# Altium schematic sheet IC's.SchDoc
size Letter
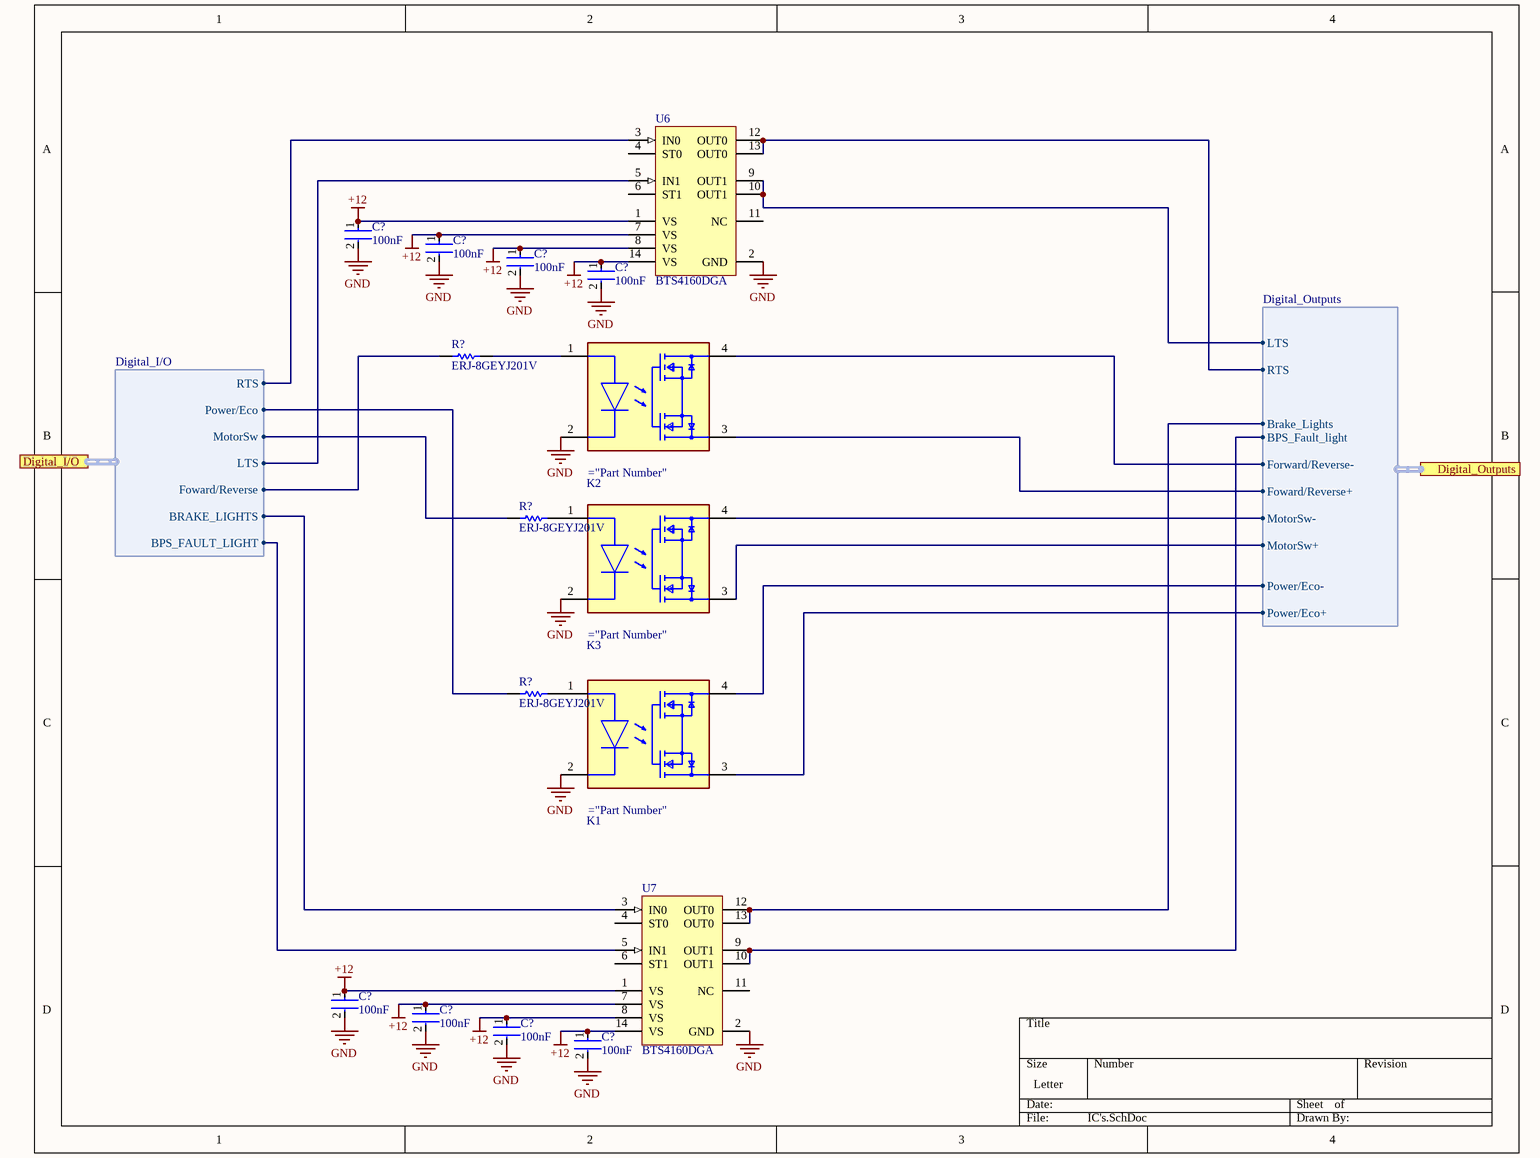
[diagram p0: IC's.SchDoc]

## Parts
(Parts that share a designator on the sheet are numbered #1, #2 ... from top to bottom, then left to right.)
C?#1  100nF  [Kemet_C0603_IPC_A]
C?#2  100nF  [Kemet_C0603_IPC_A]
C?#3  100nF  [Kemet_C0603_IPC_A]
C?#4  100nF  [Kemet_C0603_IPC_A]
C?#5  100nF  [Kemet_C0603_IPC_A]
C?#6  100nF  [Kemet_C0603_IPC_A]
C?#7  100nF  [Kemet_C0603_IPC_A]
C?#8  100nF  [Kemet_C0603_IPC_A]
K1  TLP3123_F  (value not drawn)
K2  TLP3123_F  (value not drawn)
K3  TLP3123_F  (value not drawn)
R?#1  ERJ-8GEYJ201V  [RESC3216X70X50LL05T20]
R?#2  ERJ-8GEYJ201V  [RESC3216X70X50LL05T20]
R?#3  ERJ-8GEYJ201V  [RESC3216X70X50LL05T20]
U6  BTS4160DGA  [INF-PG-DSO-14-37_N]
U7  BTS4160DGA  [INF-PG-DSO-14-37_N]

## Ports
Digital_I/O (harness Digital_I/O), Digital_Outputs (harness Digital_Outputs)

## Harnesses
Digital_I/O: BPS_FAULT_LIGHT, BRAKE_LIGHTS, Foward/Reverse, LTS, MotorSw, Power/Eco, RTS
Digital_Outputs: LTS, RTS, Power/Eco+, Power/Eco-, MotorSw+, MotorSw-, Foward/Reverse+, Forward/Reverse-, Brake_Lights, BPS_Fault_light

## Nets
+12: C?#1.1 C?#2.1 C?#3.1 C?#4.1 C?#5.1 C?#6.1 C?#7.1 C?#8.1 U6.1(VS) U6.7(VS) U6.8(VS) U6.14(VS) U7.1(VS) U7.7(VS) U7.8(VS) U7.14(VS)
GND: C?#1.2 C?#2.2 C?#3.2 C?#4.2 C?#5.2 C?#6.2 C?#7.2 C?#8.2 K1.2(C) K2.2(C) K3.2(C) U6.2(GND) U7.2(GND)
NetK1_1: K1.1(A) R?#3.2
NetK1_3: K1.3(1_DRAIN) ; port Digital_Outputs.Power/Eco+
NetK1_4: K1.4(2_DRAIN) ; port Digital_Outputs.Power/Eco-
NetK2_1: K2.1(A) R?#1.2
NetK2_3: K2.3(1_DRAIN) ; port Digital_Outputs.Foward/Reverse+
NetK2_4: K2.4(2_DRAIN) ; port Digital_Outputs.Forward/Reverse-
NetK3_1: K3.1(A) R?#2.2
NetK3_3: K3.3(1_DRAIN) ; port Digital_Outputs.MotorSw+
NetK3_4: K3.4(2_DRAIN) ; port Digital_Outputs.MotorSw-
NetR?#1_1: R?#1.1 ; port Digital_I/O.Foward/Reverse
NetR?#2_1: R?#2.1 ; port Digital_I/O.MotorSw
NetR?#3_1: R?#3.1 ; port Digital_I/O.Power/Eco
NetU6_3: U6.3(IN0) ; port Digital_I/O.RTS
NetU6_5: U6.5(IN1) ; port Digital_I/O.LTS
NetU6_9: U6.9(OUT1) U6.10(OUT1) ; port Digital_Outputs.LTS
NetU6_12: U6.12(OUT0) U6.13(OUT0) ; port Digital_Outputs.RTS
NetU7_3: U7.3(IN0) ; port Digital_I/O.BRAKE_LIGHTS
NetU7_5: U7.5(IN1) ; port Digital_I/O.BPS_FAULT_LIGHT
NetU7_9: U7.9(OUT1) U7.10(OUT1) ; port Digital_Outputs.BPS_Fault_light
NetU7_12: U7.12(OUT0) U7.13(OUT0) ; port Digital_Outputs.Brake_Lights

Not connected (* = marked no-connect by the designer): U6 4(ST0) 6(ST1) 11(NC); U7 4(ST0) 6(ST1) 11(NC)

## Library data of the parts
C?#1-C?#8 = C0603C104K5RACTU: CAP CER 0.1UF 100NF 50V X7R 0603 C0603C104K5RACTU
R?#1-R?#3 = CMP-2003-00580-1: Manufacturer: Panasonic; Part Number: ERJ-8GEYJ201V
U6 U7 = BTS4160DGA: Smart High-Side Power Switch, 2 Channels, 1.7 A Load Current, -40 to 150 degC, PG-DSO-14-37, Reel, Green; Manufacturer: Infineon; Group: Automotive Qualified; RON(max) @ 150degreesC: 320 mOhm; Recommended Operating Voltage Min.: 5.5 V; Recommended Operating Voltage Max.: 20 V; Green: TRUE; toff (max): 270 us; Load Current (typ): 1.7 A; ton (max): 250 us; RON @ 25degreesC: 160 mOhm; Ptot (max): 1.4 W; Channels: 2; PartNumber: BTS4160DGA; ComponentLink1Description: Manufacturer URL; ComponentLink2Description: Datasheet; DatasheetVersion: Rev. 1.0; ComponentLink3URL: http://www.infineon.com/dgdl/BTS723GWDS11_2007_09_25.pdf?folderId=db3a304314dca389011537739e37155f&fileId=db3a304331c8f8560131dbfec21b0da9&sId=db3a30443d67b5ca013d854df2f133e5; ComponentLink1URL: http://www.infineon.com/; Packing: Reel; ComponentLink2URL: http://www.infineon.com/dgdl/BTS+4160DGA_DS2008_03_18_neu.pdf?folderId=db3a304314dca389011537739e37155f&fileId=db3a30431a5c32f2011a957ab5875685&sId=db3a30433d68e984013d7cba76cc57cb; ComponentLink3Description: Package Specification; PackageVersion: Sep-07; Halogen-free: TRUE; Mounting Technology: Surface Mount; PackageReference: PG-DSO-14-37; PackageDescription: 14-Pin Plastic (Green) Dual Small Outline Package, 8.65 x 3.9 mm Body, 1.27 mm Pitch